# Altium project RX.PrjPcb
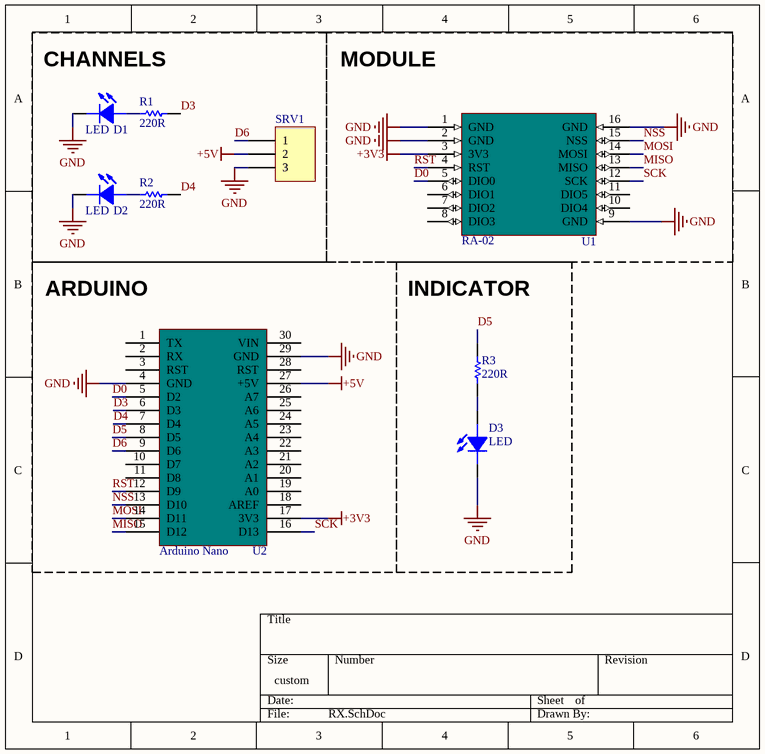
[diagram p0: RX.SchDoc]
1 sheet, 9 parts. Net scope: global (net labels, ports and power ports of the same name join across sheets).
Board files: RX.PcbDoc, PCB_Arr.PcbDoc

## Sheet RX.SchDoc
size 142 x 139 mm; SheetNumber: 1; SheetTotal: 1

### Parts
D1  LED  [LED3mm_GRN]
D2  LED  [LED3mm_GRN]
D3  LED  [LED3mm_GRN]
R1  220R  [RES-(1/4)]
R2  220R  [RES-(1/4)]
R3  220R  [RES-(1/4)]
SRV1  Header 3  [HDR1X3]  (value not drawn)
U1  RA-02  [RA-02]
U2  Arduino Nano  [Arduino_Nano328]

### Blocks framed on the sheet
CHANNELS: D1 D2 R1 R2 SRV1
MODULE: U1
ARDUINO: U2
INDICATOR: D3 R3

### Nets
+3V3: U1.3(3V3) U2.17(3V3)
+5V: SRV1.2 U2.27(+5V)
GND: D1.2(CATHODE) D2.2(CATHODE) D3.2(CATHODE) SRV1.3 U1.1(GND) U1.2(GND) U1.9(GND) U1.16(GND) U2.4(GND) U2.29(GND)
D0: U1.5(DIO0) U2.5(D2)
D3: R1.2 U2.6(D3)
D4: R2.2 U2.7(D4)
D5: R3.2 U2.8(D5)
D6: SRV1.1 U2.9(D6)
MISO: U1.13(MISO) U2.15(D12)
MOSI: U1.14(MOSI) U2.14(D11)
NSS: U1.15(NSS) U2.13(D10)
RST: U1.4(RST) U2.12(D9)
SCK: U1.12(SCK) U2.16(D13)
NetD1_1: D1.1(ANODE) R1.1
NetD2_1: D2.1(ANODE) R2.1
NetD3_1: D3.1(ANODE) R3.1

Not connected (* = marked no-connect by the designer): U1 6(DIO1) 7(DIO2) 8(DIO3) 10(DIO4) 11(DIO5); U2 1(TX) 2(RX) 3(RST) 10(D7) 11(D8) 18(AREF) 19(A0) 20(A1) 21(A2) 22(A3) 23(A4) 24(A5) 25(A6) 26(A7) 28(RST) 30(VIN)

### Library data of the parts
D1-D3 = LED 3MM: Light Emitting Diode; Designer: Ali Hafizi
R1-R3 = RES DIP PACKAGE: TOTAL DIP RESISTOR PACK; Designer: Ali Hafizi
SRV1 = Header 3: Header, 3-Pin; LatestRevisionDate: 17-Jul-2002; LatestRevisionNote: Re-released for DXP Platform.; Publisher: Altium Limited
U2 = Arduino Nano: Arduino Nano 328